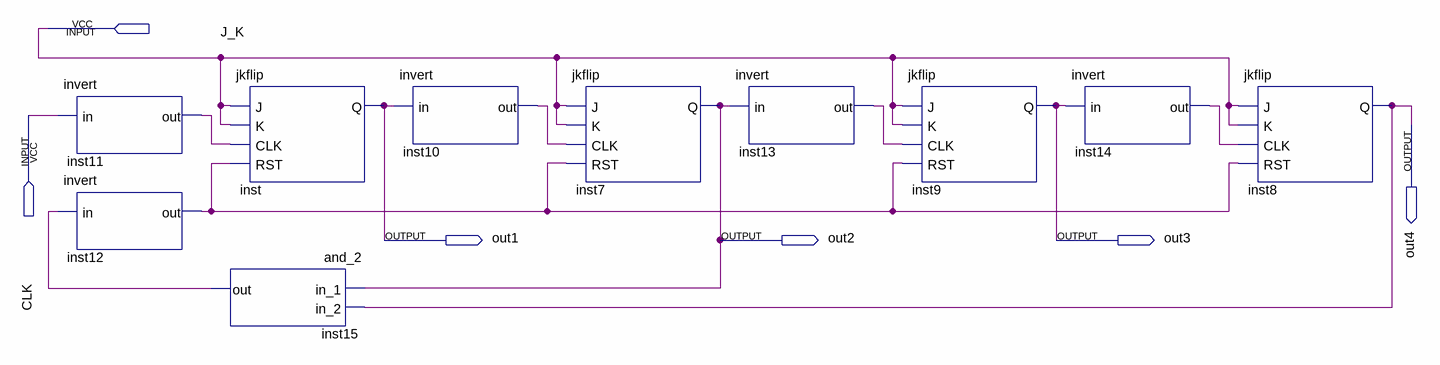
[diagram p0: schematic sheet]
// Quartus schematic mini.bdf as structural Verilog: 10 symbols, 6 pins
module mini (
  input  J_K,
  input  CLK,
  output out4,
  output out1,
  output out2,
  output out3
);

  wire inst10_out, inst11_out, inst12_out, inst13_out, inst14_out, inst15_out;

  invert inst11 (.in(CLK), .out(inst11_out));
  invert inst12 (.in(inst15_out), .out(inst12_out));
  jkflip inst (.J(J_K), .K(J_K), .CLK(inst11_out), .RST(inst12_out), .Q(out1));
  and_2 inst15 (.in_1(out2), .in_2(out4), .out(inst15_out));
  invert inst10 (.in(out1), .out(inst10_out));
  jkflip inst7 (.J(J_K), .K(J_K), .CLK(inst10_out), .RST(inst12_out), .Q(out2));
  invert inst13 (.in(out2), .out(inst13_out));
  jkflip inst9 (.J(J_K), .K(J_K), .CLK(inst13_out), .RST(inst12_out), .Q(out3));
  invert inst14 (.in(out3), .out(inst14_out));
  jkflip inst8 (.J(J_K), .K(J_K), .CLK(inst14_out), .RST(inst12_out), .Q(out4));
endmodule
